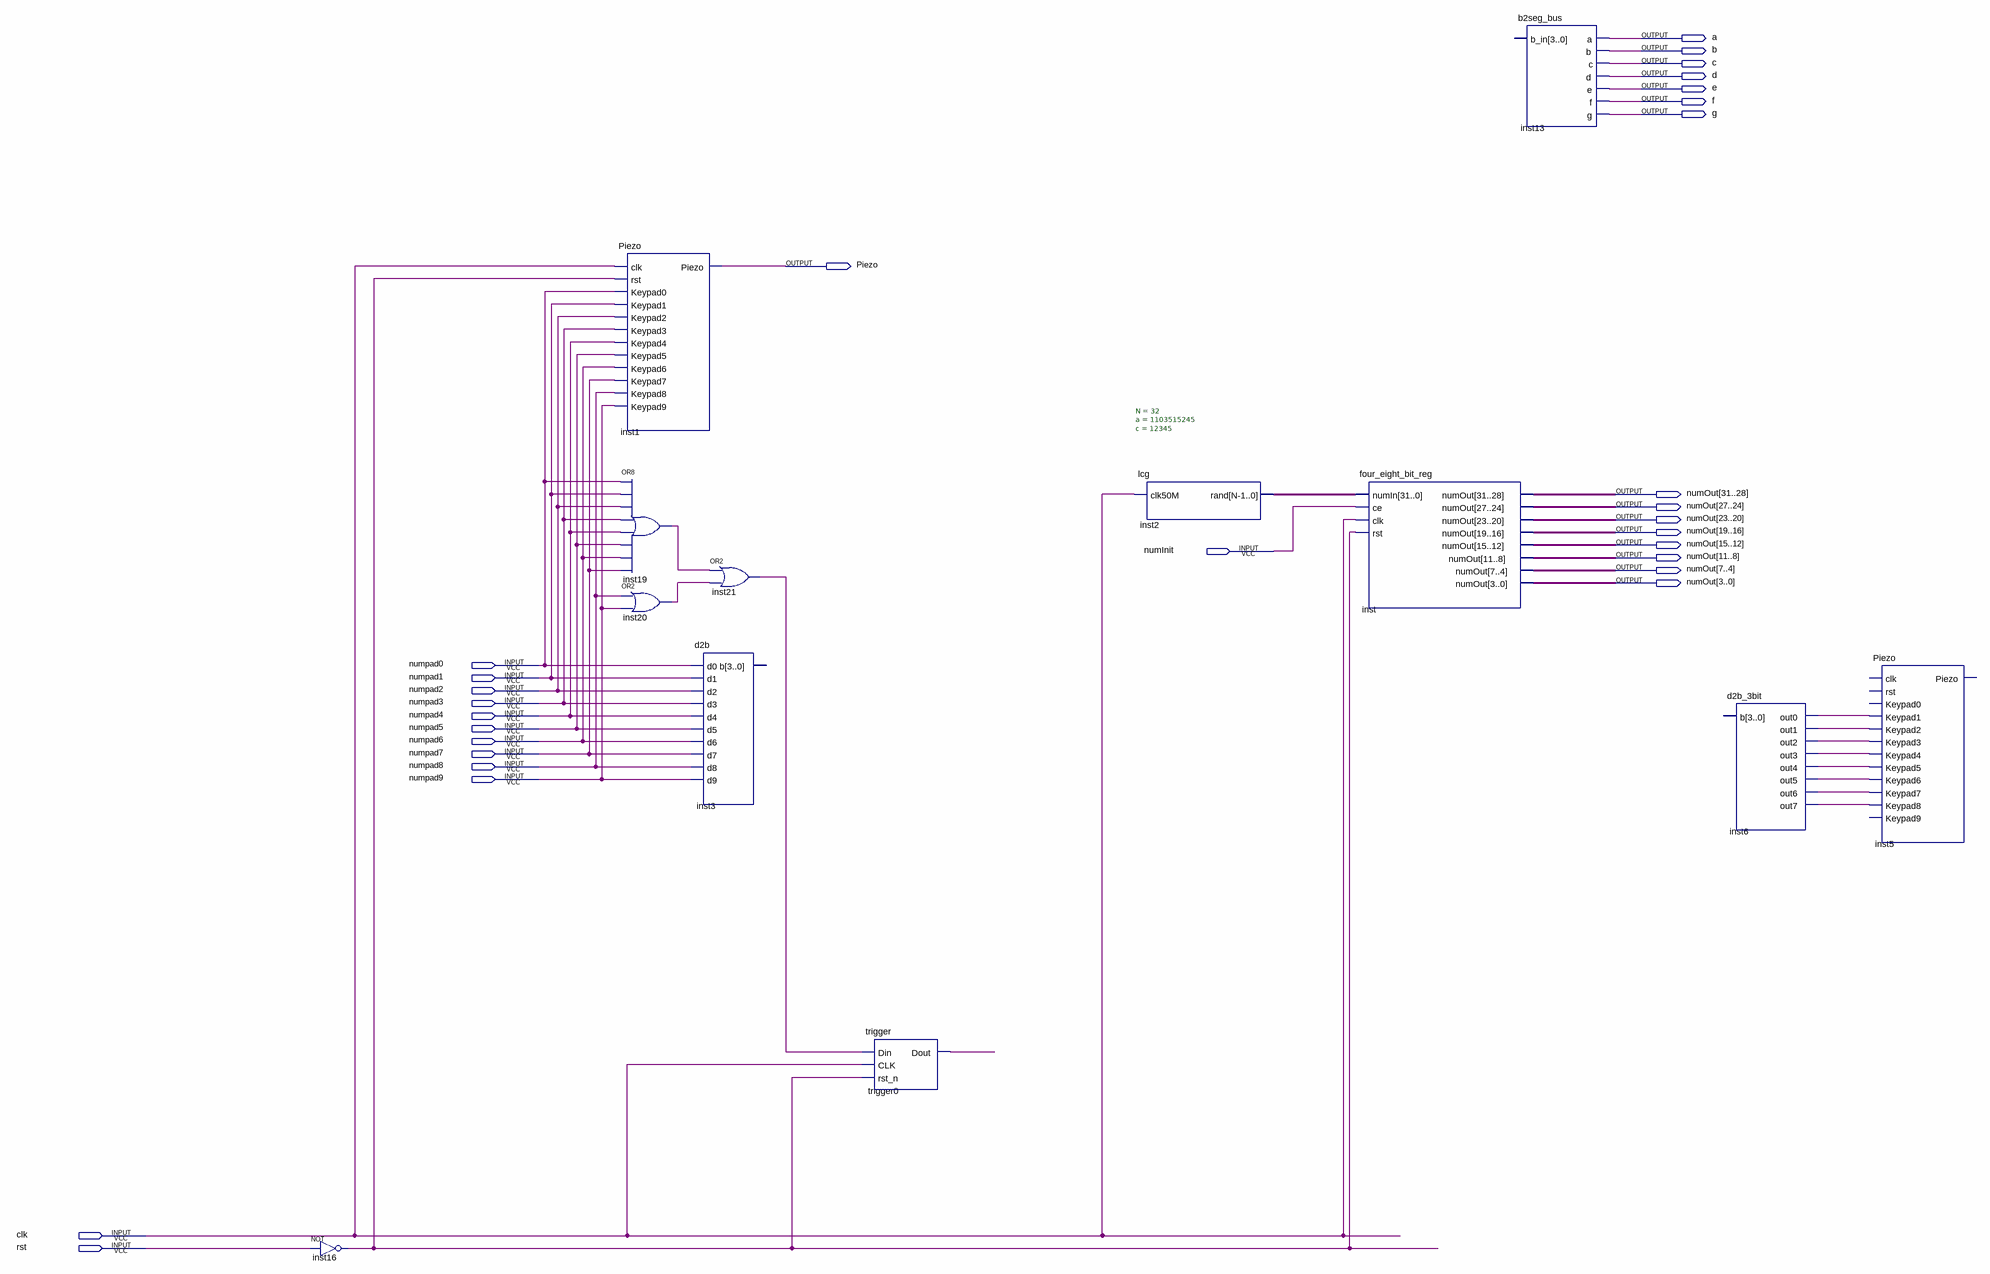
[diagram p0: schematic sheet]
// Quartus schematic termP0.bdf as structural Verilog: 12 symbols, 29 pins
module termP0 (
  input  numInit,
  input  numpad0,
  input  numpad1,
  input  numpad2,
  input  numpad3,
  input  numpad4,
  input  numpad5,
  input  numpad6,
  input  numpad7,
  input  numpad8,
  input  numpad9,
  input  clk,
  input  rst,
  output a,
  output b,
  output c,
  output d,
  output e,
  output f,
  output g,
  output Piezo,
  output [31:0] numOut
);

  wire inst6_out0, inst6_out1, inst6_out2, inst6_out3, inst6_out4, inst6_out5, inst6_out6, inst6_out7,
       inst16_out, inst19_out, inst20_out, inst21_out, trigger0_dout;
  wire [31:0] inst2_rand;

  not inst16 (inst16_out, rst);
  Piezo inst1 (
    .clk(clk), .rst(inst16_out), .Keypad0(numpad0), .Keypad1(numpad1), .Keypad2(numpad2), .Keypad3(numpad3),
    .Keypad4(numpad4), .Keypad5(numpad5), .Keypad6(numpad6), .Keypad7(numpad7), .Keypad8(numpad8),
    .Keypad9(numpad9), .Piezo(Piezo));
  or inst19 (inst19_out, numpad0, numpad1, numpad2, numpad3, numpad4, numpad5, numpad6, numpad7);
  or inst20 (inst20_out, numpad8, numpad9);
  or inst21 (inst21_out, inst19_out, inst20_out);
  d2b inst3 (
    .d0(numpad0), .d1(numpad1), .d2(numpad2), .d3(numpad3), .d4(numpad4), .d5(numpad5), .d6(numpad6),
    .d7(numpad7), .d8(numpad8), .d9(numpad9));  // open: b
  trigger trigger0 (.Din(inst21_out), .CLK(clk), .rst_n(inst16_out), .Dout(trigger0_dout));
  lcg #(.N(32), .a(1103515245), .c(12345)) inst2 (.clk50M(clk), .\rand (inst2_rand));
  four_eight_bit_reg inst (.numIn(inst2_rand), .ce(numInit), .clk(clk), .rst(inst16_out), .numOut(numOut));
  b2seg_bus inst13 (.a(a), .b(b), .c(c), .d(d), .e(e), .f(f), .g(g));  // open: b_in
  d2b_3bit inst6 (
    .out0(inst6_out0), .out1(inst6_out1), .out2(inst6_out2), .out3(inst6_out3), .out4(inst6_out4),
    .out5(inst6_out5), .out6(inst6_out6), .out7(inst6_out7));  // open: b
  Piezo inst5 (
    .Keypad1(inst6_out0), .Keypad2(inst6_out1), .Keypad3(inst6_out2), .Keypad4(inst6_out3),
    .Keypad5(inst6_out4), .Keypad6(inst6_out5), .Keypad7(inst6_out6), .Keypad8(inst6_out7));  // open: clk, rst, Keypad0, Keypad9, Piezo
endmodule
